# Altium schematic sheet Part3.SchDoc
size A
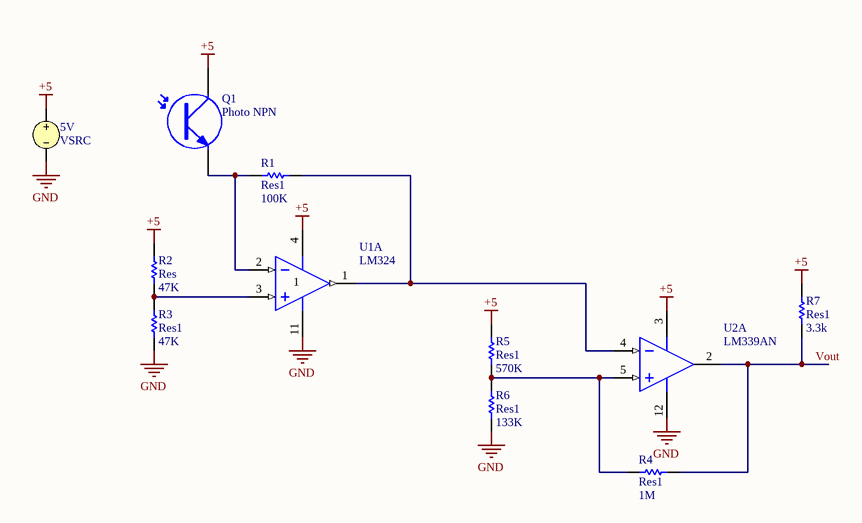
[diagram p0: Part3.SchDoc]

## Parts
5V  VSRC
Q1  Photo NPN  [SFM-T2(3)/X1.6V]
R1  Res1  value 100K  [AXIAL-0.3]
R2  Res  value 47K  [AXIAL-0.3]
R3  Res1  value 47K  [AXIAL-0.3]
R4  Res1  value 1M  [AXIAL-0.3]
R5  Res1  value 570K  [AXIAL-0.3]
R6  Res1  value 133K  [AXIAL-0.3]
R7  Res1  value 3.3k  [AXIAL-0.3]
U1  LM324  [DIP-14]  (part A of 4)
U2  LM339AN  [DIP-14/D19.7]  (part A of 4)

## Nets
+5: 5V.1 Q1.1(C) R2.1 R5.2 R7.2 U1.4(V+) U2.3(V+)
GND: 5V.2 R3.2 R6.1 U1.11(GND) U2.12(GND)
Vout: R4.2 R7.1 U2.2(OUT)
NetQ1_3: Q1.3(E) R1.2 U1.2(IN-)
NetR1_1: R1.1 U1.1(OUT) U2.4(IN-)
NetR2_2: R2.2 R3.1 U1.3(IN+)
NetR4_1: R4.1 R5.1 R6.2 U2.5(IN+)

## Library data of the parts
5V = VSRC: Voltage Source; Note: PCB Footprint - Not required; Value: +5; Published: 8-Jun-2000; LatestRevisionDate: 17-Jul-2002; LatestRevisionNote: Re-released for DXP Platform.; PackageReference: Not Applicable; Publisher: Altium Limited
Q1 = Photo NPN: NPN Phototransistor; Manufacturer: Generic Components; Class: Optoelectronic; Published: 1999
R1-R7 = Res1: Resistor; Manufacturer: Generic Components; Class: Passive; Published: 08/06/2000; Publisher: Altium Hobart Technology Centre; SubClass: Resistor
U1 = LM324AJ: Low-Power Quad Operational Amplifier; Manufacturer: National Semiconductor; Published: 15/04/2002; Publisher: Altium Hobart Technology Centre; Class: Amplifier; SubClass: Operational Amplifier
U2 = LM339AN: Quad Single-Supply Comparator; Manufacturer: Motorola; Class: Analog; Published: 15/04/2002; Publisher: Altium Hobart Technology Centre; SubClass: Comparator